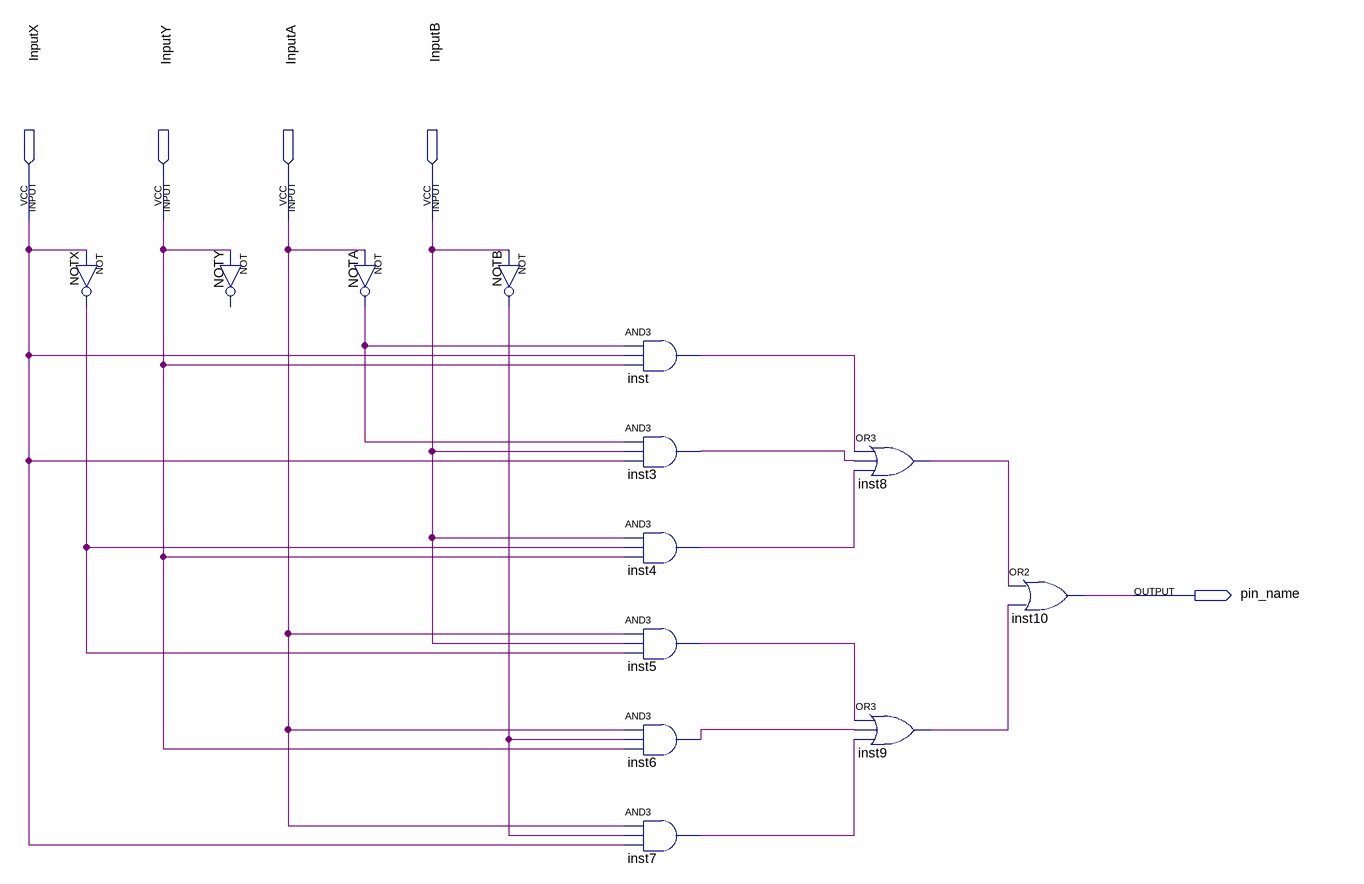
[diagram p0: schematic sheet]
// Quartus schematic Lab6.bdf as structural Verilog: 13 symbols, 5 pins
module Lab6 (
  input  InputX,
  input  InputY,
  input  InputA,
  input  InputB,
  output pin_name
);

  wire inst3_out, inst4_out, inst5_out, inst6_out, inst7_out, inst8_out, inst9_out, inst_out, NOTA_out,
       NOTB_out, NOTX_out;

  not NOTX (NOTX_out, InputX);
  // NOT NOTY has open pins: IN=InputY, OUT=open
  not NOTA (NOTA_out, InputA);
  not NOTB (NOTB_out, InputB);
  and inst (inst_out, NOTA_out, InputX, InputY);
  and inst3 (inst3_out, NOTA_out, InputB, InputX);
  and inst4 (inst4_out, InputB, NOTX_out, InputY);
  and inst5 (inst5_out, InputA, InputB, NOTX_out);
  and inst6 (inst6_out, InputA, NOTB_out, InputY);
  and inst7 (inst7_out, InputA, NOTB_out, InputX);
  or inst8 (inst8_out, inst_out, inst3_out, inst4_out);
  or inst9 (inst9_out, inst5_out, inst6_out, inst7_out);
  or inst10 (pin_name, inst8_out, inst9_out);
endmodule
